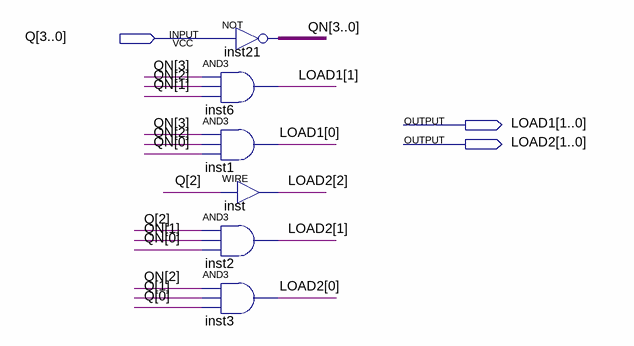
[diagram p0: schematic sheet]
// Quartus schematic LOAD1.bdf as structural Verilog: 6 symbols, 3 pins
module LOAD1 (
  input  [3:0] Q,
  output [1:0] LOAD1,
  output [2:0] LOAD2
);

  wire [3:0] QN;

  and inst6 (LOAD1[1], QN[3], QN[2], QN[1]);
  and inst1 (LOAD1[0], QN[3], QN[2], QN[0]);
  and inst2 (LOAD2[1], Q[2], QN[1], QN[0]);
  and inst3 (LOAD2[0], QN[2], Q[1], Q[0]);
  assign QN = ~Q;  // NOT inst21, 4 bits wide
  assign LOAD2[2] = Q[2];  // WIRE inst
endmodule
